# EAGLE design smart-pedal (EAGLE 8.5.2)
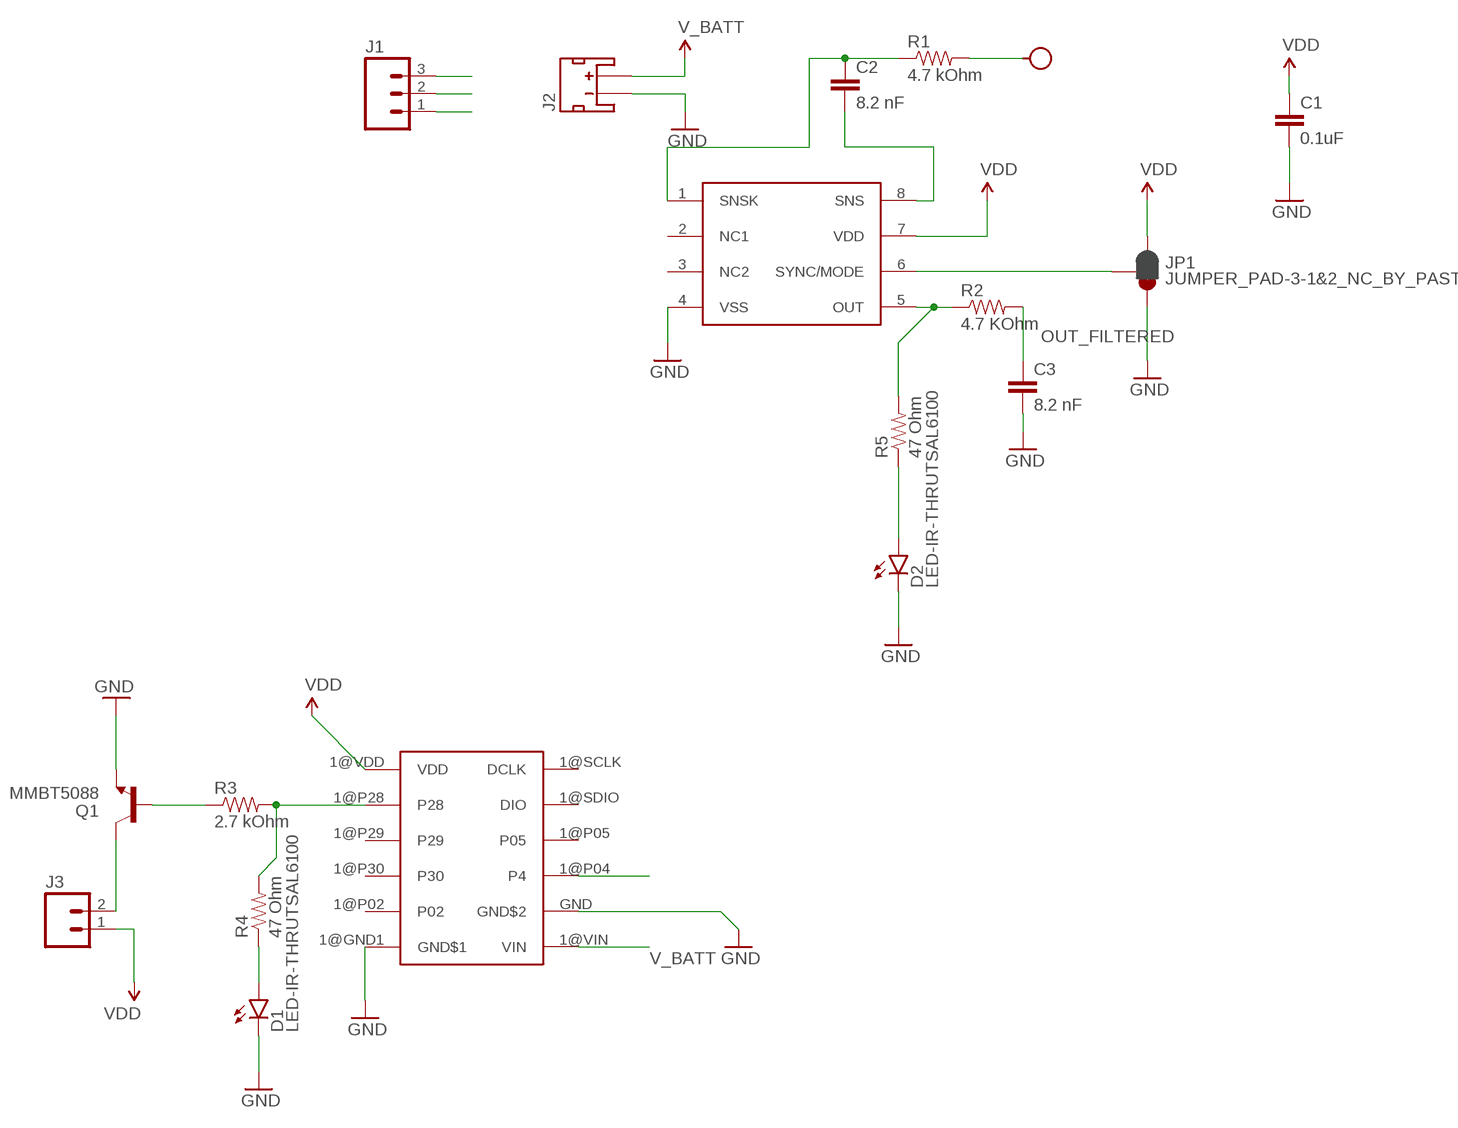
[diagram p0: schematic, sheet 1]

## Parts
C1  0.1uF  0.1UF-25V(+80/-20%)(0603)  [0603-CAP]
C2  8.2 nF  CAP0603-CAP  [0603-CAP]
C3  8.2 nF  CAP0603-CAP  [0603-CAP]
D1  LED-IR-THRUTSAL6100  [LED5MM]
D2  LED-IR-THRUTSAL6100  [LED5MM]
H1  SEW_HOLE-SMALL  [SIMPLE_HOLE_SM]
J1  M03LOCK  [1X03_LOCK]
J2  JST_2MM_MALE  [JST-2-SMD]
J3  M02LOCK  [1X02_LOCK]
JP1  JUMPER_PAD-3-1&2_NC_BY_PASTE  [PAD-HUMPER-3-1&2_NC_BY_PASTE_YES_SILK_FULL_BOX]
Q1  MMBT5088  TRANSISTOR_NPNMMBT5088  [SOT23-3]
R1  4.7 kOhm  RESISTOR0603-RES  [0603-RES]
R2  4.7 KOhm  RESISTOR0603-RES  [0603-RES]
R3  2.7 kOhm  RESISTOR0603-RES  [0603-RES]
R4  47 Ohm  RESISTOR0603-RES  [0603-RES]
R5  47 Ohm  RESISTOR0603-RES  [0603-RES]
U$1  AT42QT1011  [UDFN8]
U$2  NANOV2  [NANOV2]

## Nets
CAP: H1.P$1 R1.2
GND: C1.2 C3.2 D1.K(C) D2.K(C) J1.1 J2.1(-) JP1.3 Q1.2(E) U$1.4(VSS) U$2.1@GND1(GND$1) U$2.GND(GND$2)
MOTOR_OUT: J1.3 R3.2 R4.2 U$2.1@P28(P28)
N$1: J3.2 Q1.3(C)
N$2: Q1.1(B) R3.1
N$4: D1.A R4.1
N$5: D2.A R5.1
OUT: R2.1 R5.2 U$1.5(OUT)
OUT_FILTERED: C3.1 J1.2 R2.2 U$2.1@P04(P4)
SNS: C2.2 U$1.8(SNS)
SNSK: C2.1 R1.1 U$1.1(SNSK)
SYNC: JP1.2 U$1.6(SYNC/MODE)
V_BATT: J2.2(+) U$2.1@VIN(VIN)
VDD: C1.1 J3.1 JP1.1 U$1.7(VDD) U$2.1@VDD(VDD)
Unconnected: J2.NC1(PAD1) J2.NC2(PAD2) U$1.2(NC1) U$1.3(NC2) U$2.1@P02(P02) U$2.1@P05(P05) U$2.1@P29(P29) U$2.1@P30(P30) U$2.1@SCLK(DCLK) U$2.1@SDIO(DIO)

## Library data of the parts
C1 = SparkFun-Capacitors:0.1UF-25V(+80/-20%)(0603): CAP-00810 Ceramic Standard decoupling cap; PROD_ID: CAP-00810
C2 C3 = SparkFun-Capacitors:CAP: Capacitor Standard 0603 ceramic capacitor, and 0.1" leaded capacitor.
D1 D2 = SparkFun-LED:LED-IR-THRU; PROD_ID: DIO-12058
H1 = LilyPad-Wearables:SEW_HOLE-SMALL: .070" hole with 20mil annular ring
J1 = SparkFun-Connectors:M03: Header 3 Standard 3-pin 0.1" header. Use with straight break away headers (SKU : PRT-00116), right angle break away headers (PRT-00553), swiss pins (PRT-00743), machine pins (PRT-00117), and female headers (PRT-00115). Molex polarized connector foot print use with SKU : PRT-08232 with associated crimp pins and housings.
J2 = SparkFun-Connectors:JST_2MM_MALE: Mates to single-cell LiPo batteries. CONN-11443 Now with smashable polarity marks!; BTM_NEG: -; BTM_POS: +; PROD_ID: CONN-11443; TOP_NEG: -; TOP_POS: +
J3 = SparkFun-Connectors:M02: Standard 2-pin 0.1" header. Use with - straight break away headers ( PRT-00116) - right angle break away headers (PRT-00553) - swiss pins (PRT-00743) - machine pins (PRT-00117) - female headers (PRT-00115) Molex polarized connector foot print use with: PRT-08233 with associated crimp pins and housings. 2.54_SCREWTERM for use with PRT-10571. 3.5mm Screw Terminal footprints for PRT-08084 5mm Screw Terminal footprints for use with PRT-08432
JP1 = SparkFun-Passives:JUMPER_PAD-3-1&2_NC_BY_PASTE
Q1 = SparkFun-DiscreteSemi:TRANSISTOR_NPN: Generic NPN BJT MMBT2222A - TRANS-08049 (SOT-23, 1A 40V) MPSA42 - TRANS-09116 (SOT-23, 500mA 300V) MMBT5088LT1G - TRANS-11160 (SOT-23, 50 mA 30V) BC547 - COM-08928 <http://www.sparkfun.com/products/8928> (TO-92 45V 100mA) (1.Collector 2.Base 3.Emitter) 2N3904 - COM-00521 <http://www.sparkfun.com/products/521> (TO-92 40V 200mA) (1.Emitter 2.Base 3.Collector) P2N2222A - COM-12852 <http://www.sparkfun.com/products/12852> (TO-92 40V 600mA) (1.Collector 2.Base 3.Emitter); PROD_ID: TRANS-11160
R1 R3-R5 = SparkFun-Passives:RESISTOR: Resistor Basic schematic elements and footprints for 0603, 1206, and PTH resistors.
R2 = SparkFun-Passives:RESISTOR: Resistor Basic schematic elements and footprints for 0603, 1206, and PTH resistors.; SPICEPREFIX: R
U$1 = radu-eagle-lib:AT42QT1011
U$2 = radu-eagle-lib:NANOV2

## Board
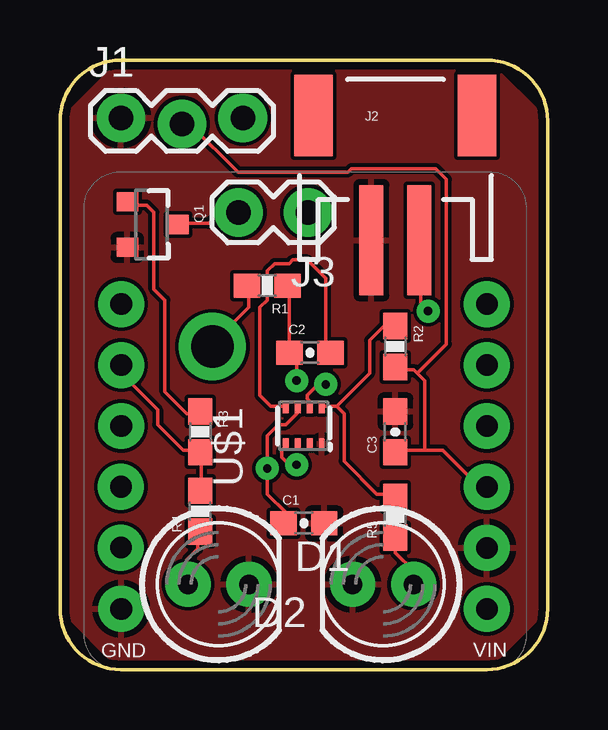
[diagram p1: board, top side]
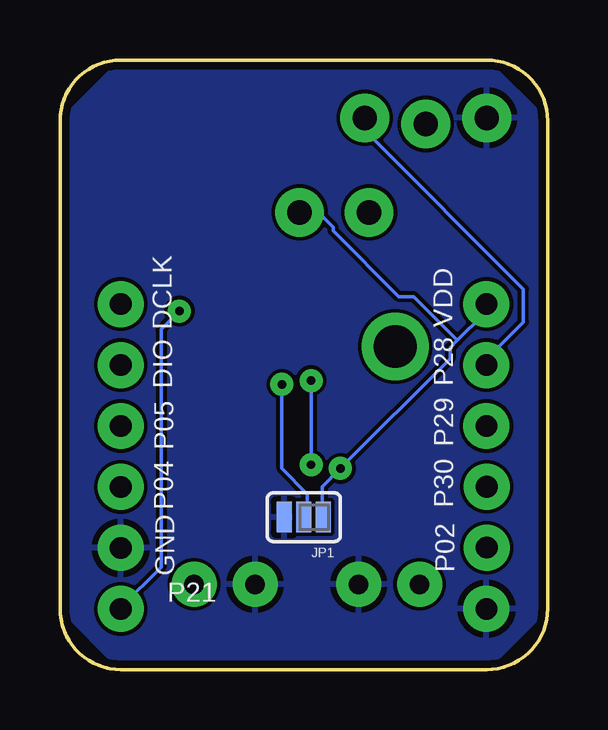
[diagram p2: board, bottom side, seen from below]

Size 20.32 x 25.4 mm. Coordinates in mm from the lower left corner, seen from the top.
Outline: 2.54,0 arc-90 0,2.54 0,22.86 arc-90 2.54,25.4 17.78,25.4 arc-90 20.32,22.86 20.32,2.54 arc-90 17.78,0 2.54,0
Copper layers (1*16): Top 0.035mm / dielectric 1.5mm / Bottom 0.035mm
Design rules "default *": minimum track width 6mil, minimum drill 0.35mm, track to track 6mil, track to pad 6mil, pad to pad 6mil, via to via 6mil, smd to smd 3mil, copper to edge 12mil, drill to drill 6mil, minimum pad ring 20mil, minimum via ring 12mil, stop-mask expansion 4mil, vias tented up to drill 0mil, thermal gap 10mil

### Footprints (pad centres in the part's own frame; a part is rotated, then mirrored left to right if it is on the bottom)
0603-CAP = smd 1.1 x 1: 1 -0.85,0; 2 0.85,0
LED5MM = drill 0.813 pad 1.88: A -1.27,0; K 1.27,0
SIMPLE_HOLE_SM = drill 1.778 pad 2.286: P$1 0,0
1X03_LOCK = drill 1.016 pad 1.88: 1 0,0.127; 2 2.54,-0.127; 3 5.08,0.127
JST-2-SMD = smd 1 x 4.6: 1 -1,-3.7; 2 1,-3.7 | smd 1.6 x 3.4: NC1 -3.4,1.5; NC2 3.4,1.5
1X02_LOCK = drill 1.016 pad 1.88: 1 -0.178,0; 2 2.718,0
PAD-HUMPER-3-1&2_NC_BY_PASTE_YES_SILK_FULL_BOX = smd 0.635 x 1.27: 1 -0.813,0; 2 0,0; 3 0.813,0
SOT23-3 = smd 0.8 x 0.9: 1 -0.95,-1; 2 0.95,-1; 3 0,1.1
0603-RES = smd 1.1 x 1: 1 -0.85,0; 2 0.85,0
UDFN8 = smd 0.45 x 0.25: 1 -0.75,0.75; 2 -0.75,0.25; 3 -0.75,-0.25; 4 -0.75,-0.75; 5 0.75,-0.75; 6 0.75,-0.25; 7 0.75,0.25; 8 0.75,0.75
NANOV2 = drill 0.9 pad 1.8: 1@GND1 15.25,2.53; 1@P02 0,2.54; 1@P04 15.25,5.07; 1@P05 15.25,7.61; 1@P28 0.01,10.15; 1@P29 0.01,7.61; 1@P30 0,5.08; 1@SCLK 15.25,12.69; 1@SDIO 15.25,10.15; 1@VDD 0.01,12.69 | drill 0.9 pad 1.6: 1@VIN 15.25,-0.01; GND 0.01,-0.01

### Placement (x,y rotation side)
C1  10.16,6.1 0 top
C2  10.41,13.21 0 top
C3  13.97,9.91 90 top
D1  6.6,3.56 0 top
D2  13.46,3.56 180 top
H1  6.35,13.46 0 top
J1  2.54,22.86 0 top
J2  13.97,21.59 0 top
J3  10.16,19.05 180 top
JP1  10.16,6.35 180 bottom
Q1  3.81,18.54 270 top
R1  8.64,16 180 top
R2  13.97,13.46 270 top
R3  5.84,9.91 270 top
R4  5.84,6.6 90 top
R5  13.97,6.35 90 top
U$1  10.16,10.16 90 top
U$2  2.54,2.54 0 top

### Tracks (layer width: path | path; a pad name or v marks a point on that pad's centre or on a via)
CAP
  Top 0.152: R1.2 7.87,16 7.87,15.09 6.35,13.56 H1.P$1
GND
  pour Bottom: 2.54,0 0,2.54 0,22.86 2.54,25.4 17.78,25.4 20.32,22.86 20.32,2.54 17.78,0
  pour Top: 2.54,0 0,2.54 0,22.86 2.54,25.4 17.78,25.4 20.32,22.86 20.32,2.54 17.78,0
MOTOR_OUT
  Top 0.152: R4.2 5.89,7.47 5.89,8.99 R3.2 5.74,9.14 5.13,9.14 4.06,10.21 4.06,10.82 2.69,12.19 2.69,12.65 U$2.1@P28
  Bottom 0.152: J1.3 7.57,22.86 7.57,22.4 1.02,15.85 1.02,14.48 2.69,12.8 U$2.1@P28
N$1
  Top 0.152: J3.2 6.65,19.05 6.2,18.59 4.98,18.59 Q1.3
N$2
  Top 0.152: Q1.1 2.84,19.35 3.61,19.35 3.91,19.05 3.91,15.85 4.37,15.39 4.37,11.58 5.28,10.67 5.74,10.67 R3.1
N$4
  Top 0.152: R4.1 5.74,5.64 5.74,5.03 5.28,4.57 5.28,3.66 D1.A
N$5
  Top 0.152: R5.1 13.97,4.88 14.73,4.11 D2.A
OUT
  Top 0.152: 11.53,10.97 10.92,10.97 U$1.5 | 11.53,10.97 12.9,12.34 12.9,13.72 13.51,14.33 13.97,14.33 R2.1 | 11.53,10.97 11.84,10.67 11.84,8.69 13.21,7.31 13.97,7.31 R5.2
OUT_FILTERED
  Top 0.152: 15.19,9.14 15.95,9.14 17.47,7.62 U$2.1@P04 | 15.19,9.14 13.97,9.14 C3.1 | 14.88,12.34 15.19,12.04 15.19,9.14 | 14.88,12.34 14.73,12.5 13.97,12.5 R2.2 | 14.88,12.34 16.1,13.56 16.1,20.42 15.65,20.88 12.14,20.88 11.99,20.73 7.42,20.73 5.44,22.71 5.13,22.71 J1.2
SNS
  Top 0.152: U$1.8 9.4,10.97 8.79,10.97 8.33,11.43 8.33,15.09 8.64,15.39 8.64,16.61 8.94,16.92 9.55,16.92 9.7,17.07 10.31,17.07 11.07,16.31 11.07,13.41 11.23,13.26 C2.2
SNSK  (via drill 0.35)
  Top 0.152: v9.86,8.53 9.55,8.53 9.25,8.84 9.25,9.14 9.4,9.3 U$1.1 | v9.86,12.04 9.86,12.95 9.7,13.11 C2.1 9.55,13.26 9.55,16 R1.1
  Bottom 0.152: v9.86,12.04 v9.86,8.53
SYNC  (via drill 0.35)
  Top 0.152: v11.07,11.89 10.77,11.89 10.31,11.43 10.31,11.28 10.46,11.12 10.46,10.97 U$1.6
  Bottom 0.152: v11.07,11.89 11.07,8.38 10.01,7.31 10.01,6.55 10.16,6.4 JP1.2
V_BATT  (via drill 0.35)
  Top 0.152: v15.34,14.93 15.04,15.24 15.04,17.83 J2.2
  Bottom 0.152: v15.34,14.93 16.1,14.17 16.1,4.27 17.78,2.59 U$2.1@VIN
VDD  (via drill 0.35)
  Top 0.152: U$1.7 9.86,10.82 9.86,10.67 9.4,10.21 9.09,10.21 8.64,9.75 v8.64,8.38 8.64,7.31 9.4,6.55 9.4,6.1 C1.1
  Bottom 0.152: 3.76,13.72 2.69,14.78 2.69,15.09 U$2.1@VDD | 3.76,13.72 4.06,13.41 4.06,12.95 v8.64,8.38 9.4,7.62 9.4,6.4 JP1.1 | J3.1 9.55,19.05 8.94,18.44 8.94,18.29 6.2,15.54 5.59,15.54 3.76,13.72